# Altium schematic sheet Logic Port.SchDoc
size B; Author: E. Sims; Organization: Let's Build Rockets Inc.; SheetNumber: 4; SheetTotal: 4
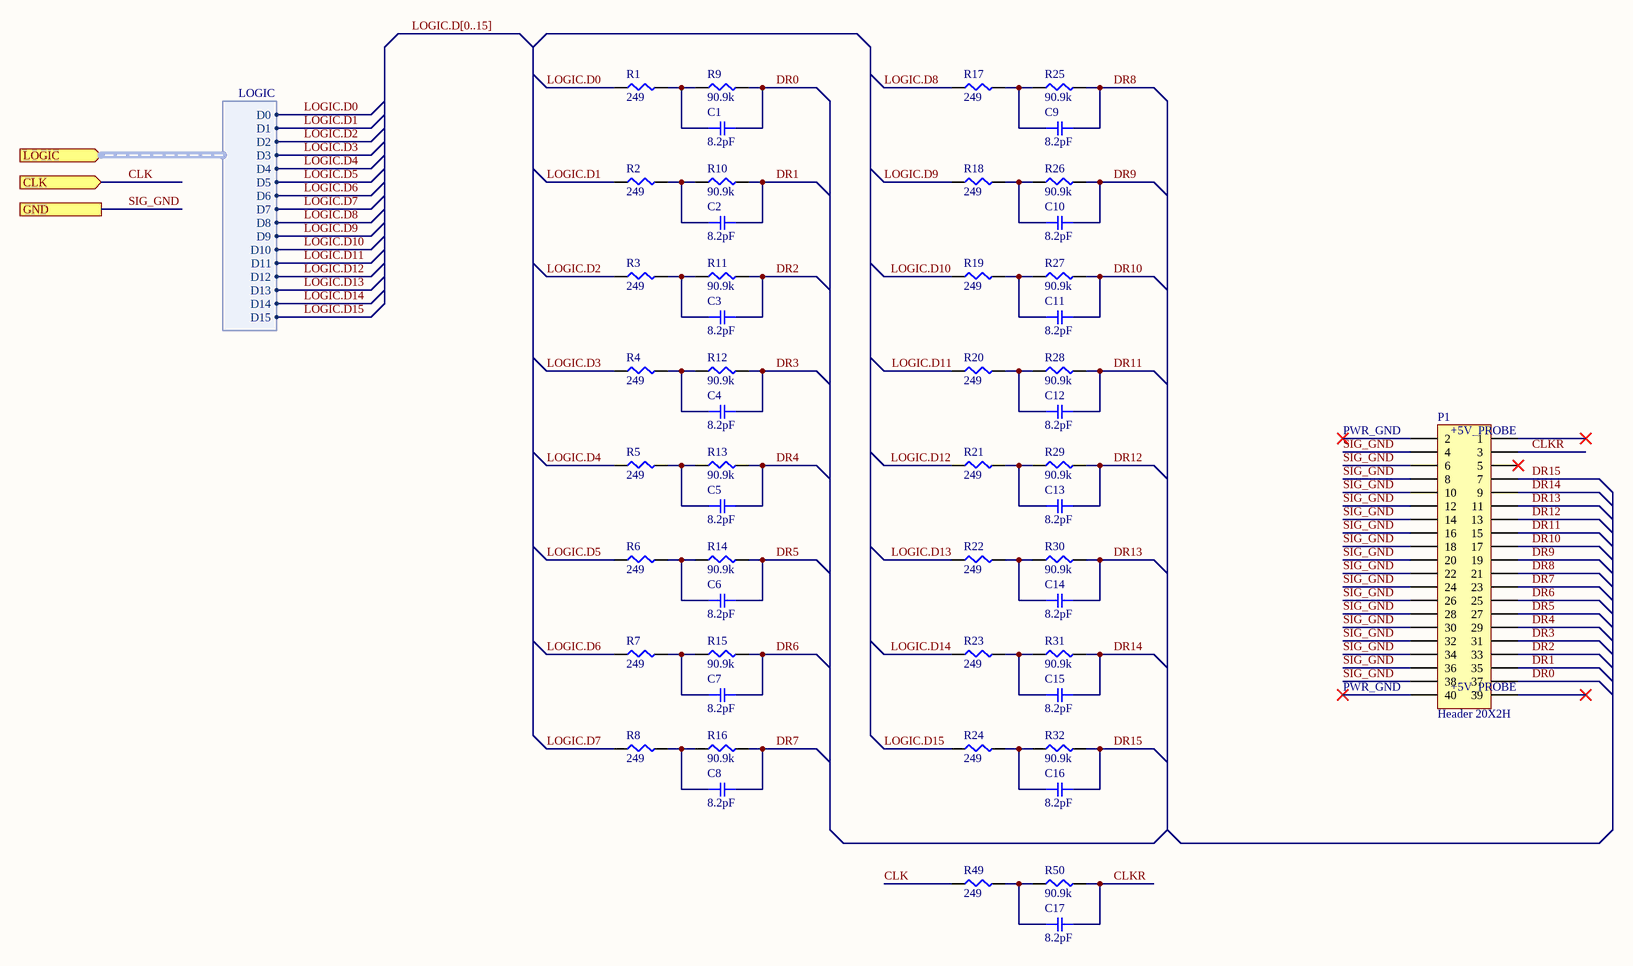
[diagram p0: Logic Port.SchDoc]

## Parts
C1  8.2pF  [SMD-0603C]
C2  8.2pF  [SMD-0603C]
C3  8.2pF  [SMD-0603C]
C4  8.2pF  [SMD-0603C]
C5  8.2pF  [SMD-0603C]
C6  8.2pF  [SMD-0603C]
C7  8.2pF  [SMD-0603C]
C8  8.2pF  [SMD-0603C]
C9  8.2pF  [SMD-0603C]
C10  8.2pF  [SMD-0603C]
C11  8.2pF  [SMD-0603C]
C12  8.2pF  [SMD-0603C]
C13  8.2pF  [SMD-0603C]
C14  8.2pF  [SMD-0603C]
C15  8.2pF  [SMD-0603C]
C16  8.2pF  [SMD-0603C]
C17  8.2pF  [SMD-0603C]
P1  Header 20X2H  [HDR2X20H]
R1  249  [SMD-0603-RES]
R2  249  [SMD-0603-RES]
R3  249  [SMD-0603-RES]
R4  249  [SMD-0603-RES]
R5  249  [SMD-0603-RES]
R6  249  [SMD-0603-RES]
R7  249  [SMD-0603-RES]
R8  249  [SMD-0603-RES]
R9  value 90.9k  [SMD-0603-RES]
R10  90.9k  [SMD-0603-RES]
R11  90.9k  [SMD-0603-RES]
R12  90.9k  [SMD-0603-RES]
R13  90.9k  [SMD-0603-RES]
R14  90.9k  [SMD-0603-RES]
R15  90.9k  [SMD-0603-RES]
R16  90.9k  [SMD-0603-RES]
R17  249  [SMD-0603-RES]
R18  249  [SMD-0603-RES]
R19  249  [SMD-0603-RES]
R20  249  [SMD-0603-RES]
R21  249  [SMD-0603-RES]
R22  249  [SMD-0603-RES]
R23  249  [SMD-0603-RES]
R24  249  [SMD-0603-RES]
R25  90.9k  [SMD-0603-RES]
R26  90.9k  [SMD-0603-RES]
R27  90.9k  [SMD-0603-RES]
R28  90.9k  [SMD-0603-RES]
R29  90.9k  [SMD-0603-RES]
R30  90.9k  [SMD-0603-RES]
R31  90.9k  [SMD-0603-RES]
R32  90.9k  [SMD-0603-RES]
R49  249  [SMD-0603-RES]
R50  90.9k  [SMD-0603-RES]

## Ports
CLK (in), GND, LOGIC (in, harness LOGIC)

## Harnesses
LOGIC: D0, D1, D2, D3, D4, D5, D6, D7, D8, D9, D10, D11, D12, D13, D14, D15

## Nets
CLK: R49.1 ; port CLK
CLKR: C17.2 P1.3 R50.2
DR0: C1.2 P1.37 R9.2
DR1: C2.2 P1.35 R10.2
DR2: C3.2 P1.33 R11.2
DR3: C4.2 P1.31 R12.2
DR4: C5.2 P1.29 R13.2
DR5: C6.2 P1.27 R14.2
DR6: C7.2 P1.25 R15.2
DR7: C8.2 P1.23 R16.2
DR8: C9.2 P1.21 R25.2
DR9: C10.2 P1.19 R26.2
DR10: C11.2 P1.17 R27.2
DR11: C12.2 P1.15 R28.2
DR12: C13.2 P1.13 R29.2
DR13: C14.2 P1.11 R30.2
DR14: C15.2 P1.9 R31.2
DR15: C16.2 P1.7 R32.2
LOGIC.D0: R1.1 ; port LOGIC.D0
LOGIC.D1: R2.1 ; port LOGIC.D1
LOGIC.D2: R3.1 ; port LOGIC.D2
LOGIC.D3: R4.1 ; port LOGIC.D3
LOGIC.D4: R5.1 ; port LOGIC.D4
LOGIC.D5: R6.1 ; port LOGIC.D5
LOGIC.D6: R7.1 ; port LOGIC.D6
LOGIC.D7: R8.1 ; port LOGIC.D7
LOGIC.D8: R17.1 ; port LOGIC.D8
LOGIC.D9: R18.1 ; port LOGIC.D9
LOGIC.D10: R19.1 ; port LOGIC.D10
LOGIC.D11: R20.1 ; port LOGIC.D11
LOGIC.D12: R21.1 ; port LOGIC.D12
LOGIC.D13: R22.1 ; port LOGIC.D13
LOGIC.D14: R23.1 ; port LOGIC.D14
LOGIC.D15: R24.1 ; port LOGIC.D15
SIG_GND: P1.4 P1.6 P1.8 P1.10 P1.12 P1.14 P1.16 P1.18 P1.20 P1.22 P1.24 P1.26 P1.28 P1.30 P1.32 P1.34 P1.36 P1.38 ; port GND
NetC1_1: C1.1 R1.2 R9.1
NetC2_1: C2.1 R2.2 R10.1
NetC3_1: C3.1 R3.2 R11.1
NetC4_1: C4.1 R4.2 R12.1
NetC5_1: C5.1 R5.2 R13.1
NetC6_1: C6.1 R6.2 R14.1
NetC7_1: C7.1 R7.2 R15.1
NetC8_1: C8.1 R8.2 R16.1
NetC9_1: C9.1 R17.2 R25.1
NetC10_1: C10.1 R18.2 R26.1
NetC11_1: C11.1 R19.2 R27.1
NetC12_1: C12.1 R20.2 R28.1
NetC13_1: C13.1 R21.2 R29.1
NetC14_1: C14.1 R22.2 R30.1
NetC15_1: C15.1 R23.2 R31.1
NetC16_1: C16.1 R24.2 R32.1
NetC17_1: C17.1 R49.2 R50.1

Not connected (* = marked no-connect by the designer): P1 1* 2* 5* 39* 40*

## Buses and harness runs
bus LOGIC.D[0..15]

## Notes on the sheet
- (near P1) PWR_GND
- (near P1) +5V_PROBE
- Let's Build Rocket's Inc. Modular Paylaod System Based on TMP-010 Rev
  For more information visit https://github.com/LetsBuildRockets/Modular-Payload-System
  This work is licensed under CC BY-NC 4.0. To view a copy of this license, visit https://creativecommons.org/licenses/by-nc/4.0
- Title
- Size:
- Date:
- Assembly Variant:
- B
- Number:
- Time:
- Revision:
- Sheet
- of
- Author:
- File:

## Library data of the parts
C1-C17 = GRM1885C1H8R2BA01D: CAP CER 8.2PF 50V NP0 0603; Manufacturer: Murata Electronics North America; Factory Stock: 0; Unit Price (USD): 0.11; Minimum Quantity: 1; Tolerance: ±0.1pF; Temperature Coefficient: C0G, NP0; Datasheets: http://www.murata.com/~/media/webrenewal/support/library/catalog/products/capacitor/mlcc/c02e.pdf; Image: //media.digikey.com/Renders/Murata%20Renders/ZRB-SERIES-0402.jpg; Digi-Key Part Number: 490-12727-1-ND; Part Number: GRM1885C1H8R2BA01D; Quantity Available: 816; @ qty: 0; Packaging: Cut Tape (CT); Series: GRM; Part Status: Active; Value: 8.2pF; Voltage: 50V; Operating Temperature: -55°C ~ 125°C; Features: -; Ratings: -; Applications: General Purpose; Mounting Type: Surface Mount, MLCC; Package / Case: 0603 (1608 Metric); Size / Dimension: 0.063" L x 0.031" W (1.60mm x 0.80mm); Height - Seated (Max): -; Thickness (Max): 0.035" (0.90mm); Lead Spacing: -; Lead Style: -
P1 = Header 20X2H: Header, 20-Pin, Dual row, Right Angle; LatestRevisionDate: 17-Jul-2002; LatestRevisionNote: Re-released for DXP Platform.; Publisher: Altium Limited
R1-R8 R17-R24 R49 = ERJ-3EKF2490V: RES SMD 249 OHM 1% 1/10W 0603; Manufacturer: Panasonic Electronic Components; Factory Stock: 0; Unit Price (USD): 0.00379; @ qty: 1500; Minimum Quantity: 1; Power (Watts): 0.1W, 1/10W; Temperature Coefficient: ±100ppm/°C; Value: 249; Part Number: ERJ-3EKF2490V; Datasheets: http://industrial.panasonic.com/www-cgi/jvcr13pz.cgi?E+PZ+3+AOA0002+ERJ3EKF2490V+7+WW; Image: //media.digikey.com/Photos/Panasonic%20Photos/MFG_ERJ-P6W%20Series.jpg; Digi-Key Part Number: P249HCT-ND; Quantity Available: 112432; Packaging: Cut Tape (CT); Series: ERJ; Part Status: Active; Tolerance: ±1%; Composition: Thick Film; Features: Automotive AEC-Q200; Operating Temperature: -55°C ~ 155°C; Package / Case: 0603 (1608 Metric); Supplier Device Package: 0603; Size / Dimension: 0.063" L x 0.031" W (1.60mm x 0.80mm); Height - Seated (Max): 0.022" (0.55mm); Number of Terminations: 2; Failure Rate: -
R9-R16 R25-R32 R50 = ERJ-3EKF9092V: RES SMD 90.9K OHM 1% 1/10W 0603; Manufacturer: Panasonic Electronic Components; Factory Stock: 0; Unit Price (USD): 0.00379; @ qty: 1500; Minimum Quantity: 1; Power (Watts): 0.1W, 1/10W; Temperature Coefficient: ±100ppm/°C; Part Number: ERJ-3EKF9092V; Datasheets: http://industrial.panasonic.com/www-cgi/jvcr13pz.cgi?E+PZ+3+AOA0002+ERJ3EKF9092V+7+WW; Image: //media.digikey.com/Photos/Panasonic%20Photos/MFG_ERJ-P6W%20Series.jpg; Digi-Key Part Number: P90.9KHCT-ND; Quantity Available: 254781; Packaging: Cut Tape (CT); Series: ERJ; Part Status: Active; Tolerance: ±1%; Composition: Thick Film; Features: Automotive AEC-Q200; Operating Temperature: -55°C ~ 155°C; Package / Case: 0603 (1608 Metric); Supplier Device Package: 0603; Size / Dimension: 0.063" L x 0.031" W (1.60mm x 0.80mm); Height - Seated (Max): 0.022" (0.55mm); Number of Terminations: 2; Failure Rate: -
  R10-R16 R25-R32 R50: Value: 90.9k